# Altium schematic sheet Bending_Machine_SCH.SchDoc
size A4; SheetNumber: 1; SheetTotal: 1
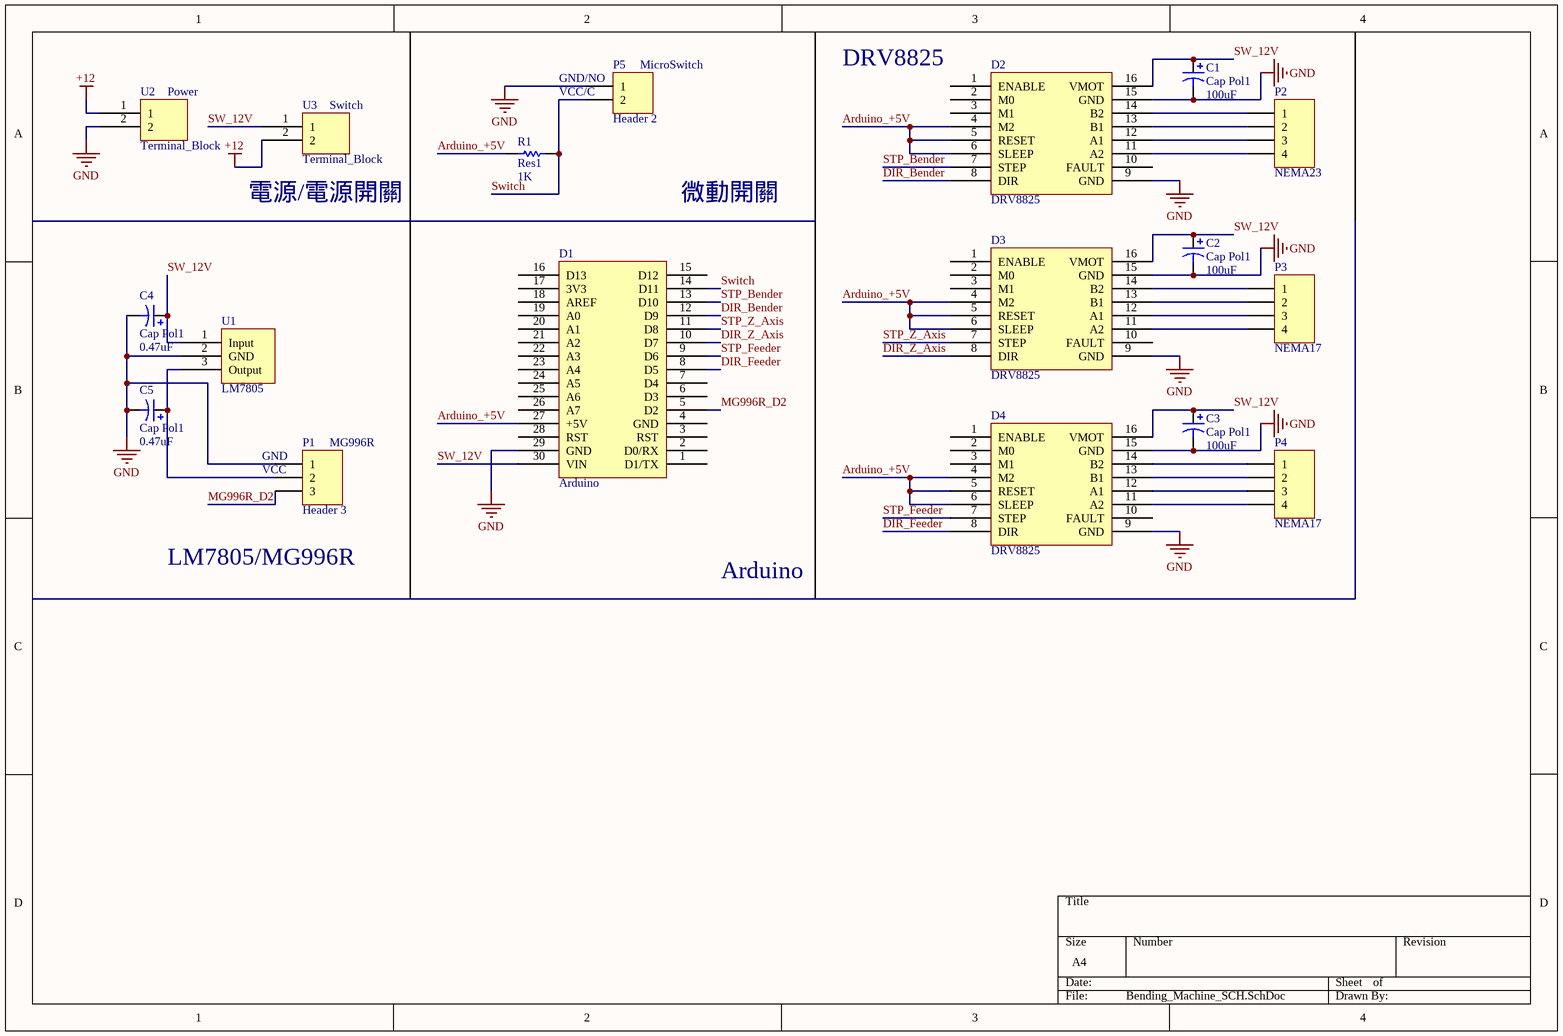
[diagram p0: Bending_Machine_SCH.SchDoc]

## Parts
C1  Cap Pol1  value 100uF  [Cap_100uF]
C2  Cap Pol1  value 100uF  [Cap_100uF]
C3  Cap Pol1  value 100uF  [Cap_100uF]
C4  Cap Pol1  value 0.47uF  [Cap_0.47uF]
C5  Cap Pol1  value 0.47uF  [Cap_0.47uF]
D1  Arduino  [Arduino]
D2  DRV8825  [DRV8825]
D3  DRV8825  [DRV8825]
D4  DRV8825  [DRV8825]
P1  Header 3  [HDR1X3]
P2  NEMA23  [HDR1X4]
P3  NEMA17  [HDR1X4]
P4  NEMA17  [HDR1X4]
P5  Header 2  [HDR1X2]
R1  Res1  value 1K  [AXIAL-0.3]
U1  LM7805  [LM7805]
U2  Terminal_Block  [terminal block]
U3  Terminal_Block  [terminal block]

## Nets
+12: U2.1 U3.2
GND: C1.2 C2.2 C3.2 C4.2 C5.2 D1.29(GND) D2.9(GND) D2.15(GND) D3.9(GND) D3.15(GND) D4.9(GND) D4.15(GND) P1.1 P5.1 U1.2(GND) U2.2
Arduino_+5V: D1.27(+5V) D2.4(M2) D2.5(RESET) D2.6(SLEEP) D3.4(M2) D3.5(RESET) D3.6(SLEEP) D4.4(M2) D4.5(RESET) D4.6(SLEEP) R1.1
DIR_Bender: D1.12(D9) D2.8(DIR)
DIR_Feeder: D1.8(D5) D4.8(DIR)
DIR_Z_Axis: D1.10(D7) D3.8(DIR)
MG996R_D2: D1.5(D2) P1.3
STP_Bender: D1.13(D10) D2.7(STEP)
STP_Feeder: D1.9(D6) D4.7(STEP)
STP_Z_Axis: D1.11(D8) D3.7(STEP)
SW_12V: C1.1 C2.1 C3.1 C4.1 D1.30(VIN) D2.16(VMOT) D3.16(VMOT) D4.16(VMOT) U1.1(Input) U3.1
Switch: D1.14(D11) P5.2 R1.2
NetC5_1: C5.1 P1.2 U1.3(Output)
NetD2_11: D2.11(A2) P2.4
NetD2_12: D2.12(A1) P2.3
NetD2_13: D2.13(B1) P2.2
NetD2_14: D2.14(B2) P2.1
NetD3_11: D3.11(A2) P3.4
NetD3_12: D3.12(A1) P3.3
NetD3_13: D3.13(B1) P3.2
NetD3_14: D3.14(B2) P3.1
NetD4_11: D4.11(A2) P4.4
NetD4_12: D4.12(A1) P4.3
NetD4_13: D4.13(B1) P4.2
NetD4_14: D4.14(B2) P4.1

Not connected (* = marked no-connect by the designer): D1 1(D1/TX) 2(D0/RX) 3(RST) 4(GND) 6(D3) 7(D4) 15(D12) 16(D13) 17(3V3) 18(AREF) 19(A0) 20(A1) 21(A2) 22(A3) 23(A4) 24(A5) 25(A6) 26(A7) 28(RST); D2 1(ENABLE) 2(M0) 3(M1) 10(FAULT); D3 1(ENABLE) 2(M0) 3(M1) 10(FAULT); D4 1(ENABLE) 2(M0) 3(M1) 10(FAULT)

## Notes on the sheet
- (near U2) Power
- (near U3) Switch
- (near P5) VCC/C
- (near P5) GND/NO
- (near P5) MicroSwitch
- DRV8825
- (near U3) 電源/電源開關
- 微動開關
- (near P1) MG996R
- (near P1) GND
- (near P1) VCC
- LM7805/MG996R
- Arduino

## Library data of the parts
C1-C5 = Cap Pol1: Polarized Capacitor (Radial); Published: 8-Jun-2000; LatestRevisionDate: 17-Jul-2002; LatestRevisionNote: Re-released for DXP Platform.; PackageReference: RB7.6-15; Publisher: Altium Limited; PackageDescription: Polarized Capacitor (Radial); 2 Leads
P1 = Header 3: Header, 3-Pin; LatestRevisionDate: 17-Jul-2002; LatestRevisionNote: Re-released for DXP Platform.; Publisher: Altium Limited
P2-P4 = Header 4: Header, 4-Pin; LatestRevisionDate: 17-Jul-2002; LatestRevisionNote: Re-released for DXP Platform.; Publisher: Altium Limited
P5 = Header 2: Header, 2-Pin; LatestRevisionDate: 17-Jul-2002; LatestRevisionNote: Re-released for DXP Platform.; Publisher: Altium Limited
R1 = Res1: Resistor; Published: 8-Jun-2000; LatestRevisionDate: 17-Jul-2002; LatestRevisionNote: Re-released for DXP Platform.; PackageReference: AXIAL-0.3; Publisher: Altium Limited; PackageDescription: Axial Device, Thru-Hole; 2 Leads; 0.3 in Pin Spacing
U2 U3 = Terminal Block